# EAGLE design DartScorePcb (EAGLE 9.5.2)
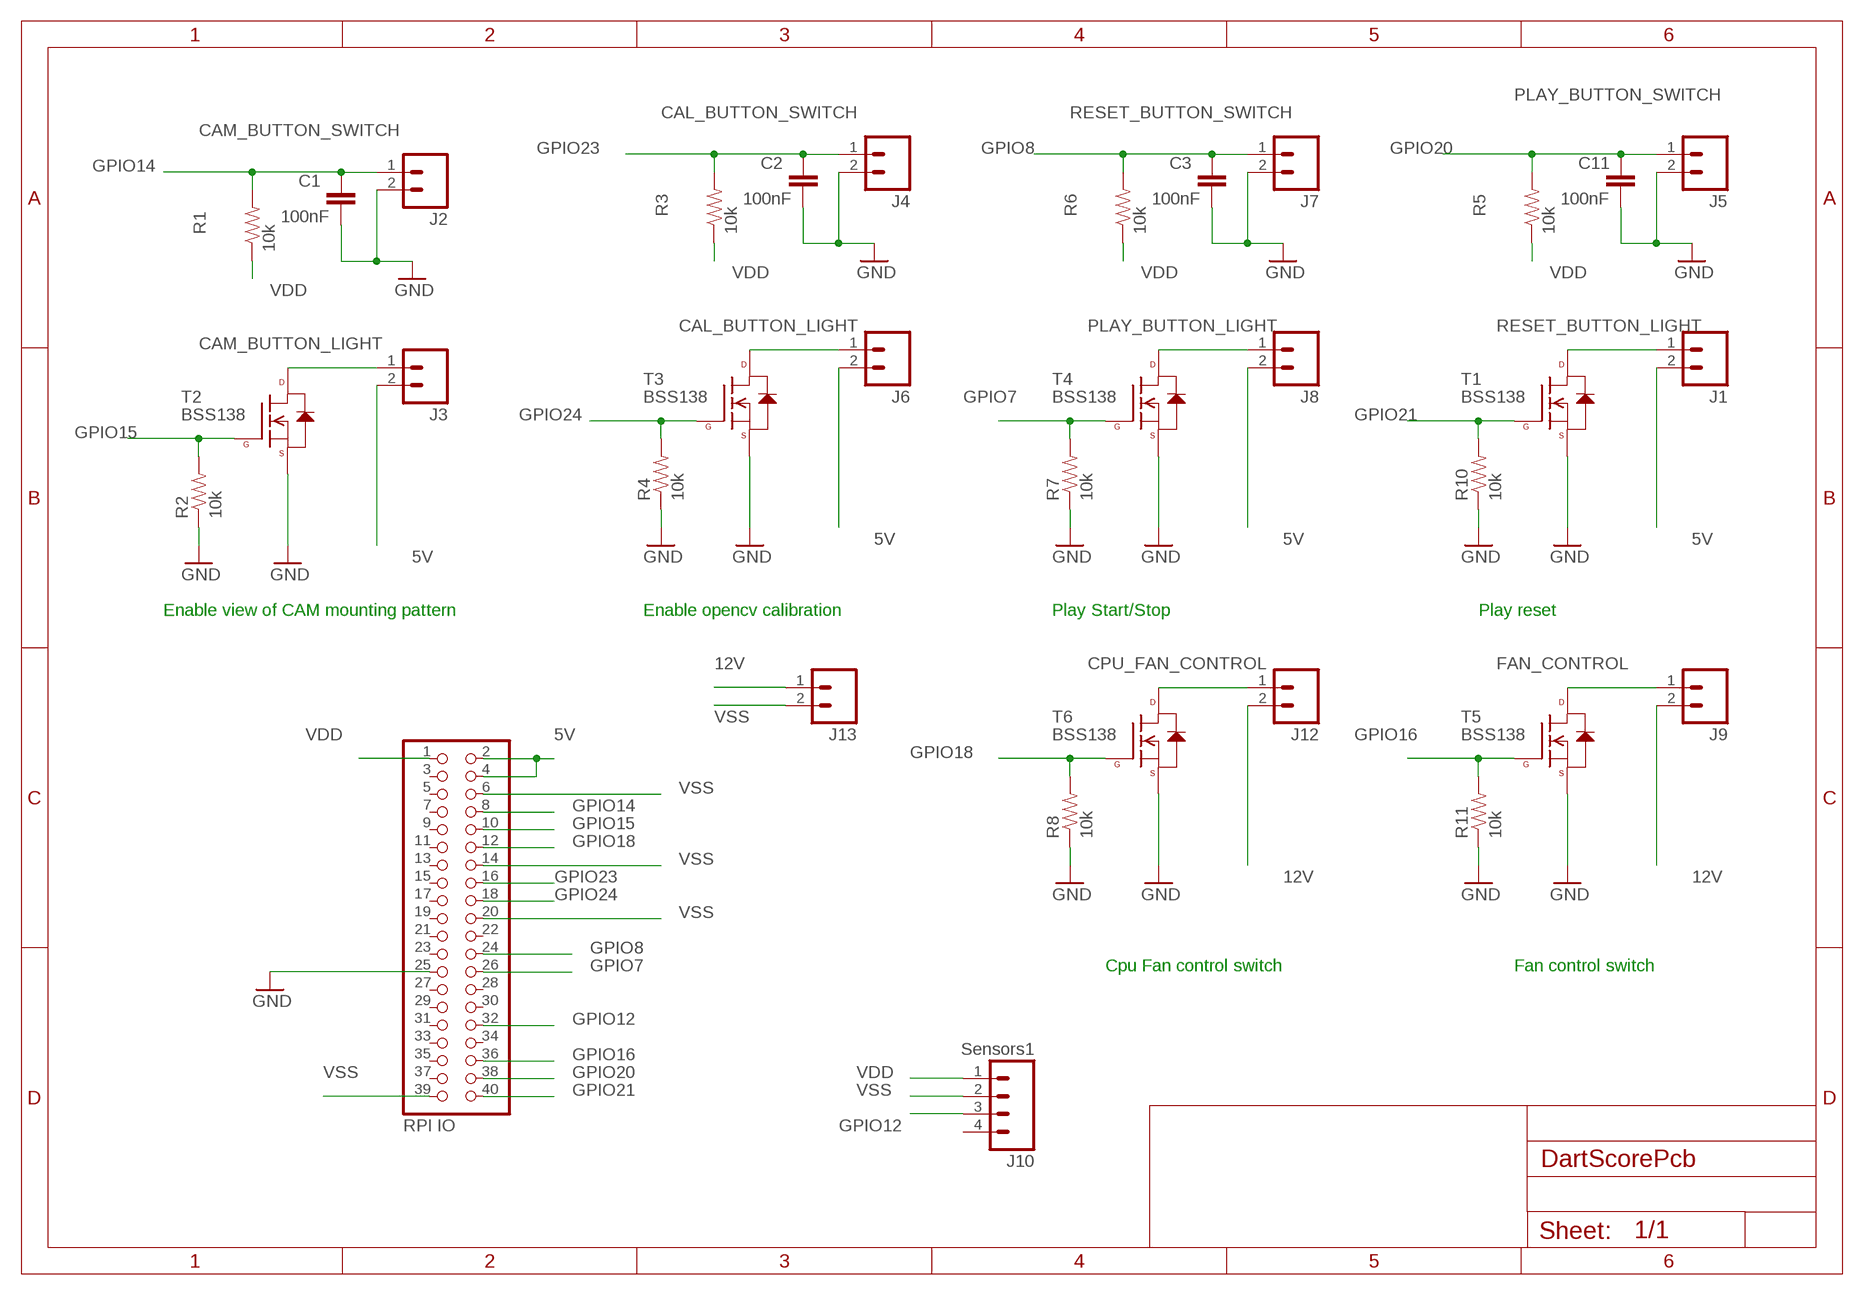
[diagram p0: schematic, sheet 1]

## Parts
C1  100nF  CAP0805  [0805]
C2  100nF  CAP0805  [0805]
C3  100nF  CAP0805  [0805]
C11  100nF  CAP0805  [0805]
J1  RESET_BUTTON_LIGHT  M02PTH  [1X02]
J2  CAM_BUTTON_SWITCH  M02PTH  [1X02]
J3  CAM_BUTTON_LIGHT  M02PTH  [1X02]
J4  CAL_BUTTON_SWITCH  M02PTH  [1X02]
J5  PLAY_BUTTON_SWITCH  M02PTH  [1X02]
J6  CAL_BUTTON_LIGHT  M02PTH  [1X02]
J7  RESET_BUTTON_SWITCH  M02PTH  [1X02]
J8  PLAY_BUTTON_LIGHT  M02PTH  [1X02]
J9  FAN_CONTROL  M02PTH  [1X02]
J10  Sensors1  M04PTH  [1X04]
J12  CPU_FAN_CONTROL  M02PTH  [1X02]
J13  CPU_FAN_CONTROL  M02PTH  [1X02]
JP2  RPI IO  PINHD-2X20  [2X20]
R1  10k  RESISTOR0805-RES  [0805]
R2  10k  RESISTOR0805-RES  [0805]
R3  10k  RESISTOR0805-RES  [0805]
R4  10k  RESISTOR0805-RES  [0805]
R5  10k  RESISTOR0805-RES  [0805]
R6  10k  RESISTOR0805-RES  [0805]
R7  10k  RESISTOR0805-RES  [0805]
R8  10k  RESISTOR0805-RES  [0805]
R10  10k  RESISTOR0805-RES  [0805]
R11  10k  RESISTOR0805-RES  [0805]
T1  BSS138  N-CHANNEL-MOSFET-BSS138  [SOT23-3]
T2  BSS138  N-CHANNEL-MOSFET-BSS138  [SOT23-3]
T3  BSS138  N-CHANNEL-MOSFET-BSS138  [SOT23-3]
T4  BSS138  N-CHANNEL-MOSFET-BSS138  [SOT23-3]
T5  BSS138  N-CHANNEL-MOSFET-BSS138  [SOT23-3]
T6  BSS138  N-CHANNEL-MOSFET-BSS138  [SOT23-3]

## Nets
5V: J1.2 J3.2 J6.2 J8.2 JP2.2 JP2.4
12V: J9.2 J12.2 J13.1
GPIO7: JP2.26 R7.2 T4.1(G)
GPIO8: C3.1 J7.1 JP2.24 R6.2
GPIO12: J10.3 JP2.32
GPIO14: C1.1 J2.1 JP2.8 R1.2
GPIO15: JP2.10 R2.2 T2.1(G)
GPIO16: JP2.36 R11.2 T5.1(G)
GPIO18: JP2.12 R8.2 T6.1(G)
GPIO20: C11.1 J5.1 JP2.38 R5.2
GPIO21: JP2.40 R10.2 T1.1(G)
GPIO23: C2.1 J4.1 JP2.16 R3.2
GPIO24: JP2.18 R4.2 T3.1(G)
N$1: J9.1 T5.3(D)
N$2: J1.1 T1.3(D)
N$3: J12.1 T6.3(D)
N$4: J3.1 T2.3(D)
N$6: J6.1 T3.3(D)
N$8: J8.1 T4.3(D)
VDD: J10.1 JP2.1 R1.1 R3.1 R5.1 R6.1
VSS: C1.2 C2.2 C3.2 C11.2 J2.2 J4.2 J5.2 J7.2 J10.2 J13.2 JP2.6 JP2.14 JP2.20 JP2.25 JP2.39 R2.1 R4.1 R7.1 R8.1 R10.1 R11.1 T1.2(S) T2.2(S) T3.2(S) T4.2(S) T5.2(S) T6.2(S) ; supply symbol labelled GND
Unconnected: J10.4 JP2.3 JP2.5 JP2.7 JP2.9 JP2.11 JP2.13 JP2.15 JP2.17 JP2.19 JP2.21 JP2.22 JP2.23 JP2.27 JP2.28 JP2.29 JP2.30 JP2.31 JP2.33 JP2.34 JP2.35 JP2.37

## Notes on the sheet
- Enable view of CAM mounting pattern | Enable opencv calibration | Play Start/Stop | Play reset
- Cpu Fan control switch | Fan control switch

## Library data of the parts
C1-C3 C11 = SparkFun-Passives:CAP: Capacitor Standard 0603 ceramic capacitor, and 0.1" leaded capacitor.
J1-J9 J12 J13 = SparkFun-Connectors:M02: Standard 2-pin 0.1" header. Use with - straight break away headers ( PRT-00116) - right angle break away headers (PRT-00553) - swiss pins (PRT-00743) - machine pins (PRT-00117) - female headers (PRT-00115) Molex polarized connector foot print use with: PRT-08233 with associated crimp pins and housings. 2.54_SCREWTERM for use with PRT-10571. 3.5mm Screw Terminal footprints for PRT-08084 5mm Screw Terminal footprints for use with PRT-08432
J10 = SparkFun-Connectors:M04: Header 4 Standard 4-pin 0.1" header. Use with straight break away headers (SKU : PRT-00116), right angle break away headers (PRT-00553), swiss pins (PRT-00743), machine pins (PRT-00117), and female headers (PRT-00115). Molex polarized connector foot print use with SKU : PRT-08231 with associated crimp pins and housings. 1MM SMD Version SKU: PRT-10208; PROD_ID: CONN-09696
JP2 = pinhead:PINHD-2X20: PIN HEADER
R1-R8 R10 R11 = SparkFun-Resistors:RESISTOR: Resistor Basic schematic elements and footprints for 0603, 1206, and PTH resistors.
T1-T6 = GeekAmmo:N-CHANNEL-MOSFET: N-Channel MOSFET Mode Field Effect Transistor; DATASHEET: http://www.fairchildsemi.com/ds/BS/BSS138.pdf; DIGIKEY: BSS138TR-ND; ELEMENT14: 2323154; URL: http://au.element14.com/fairchild-semiconductor/bss138/mosfet-n-ch-50v-220ma-sot-23/dp/2323154

## Board
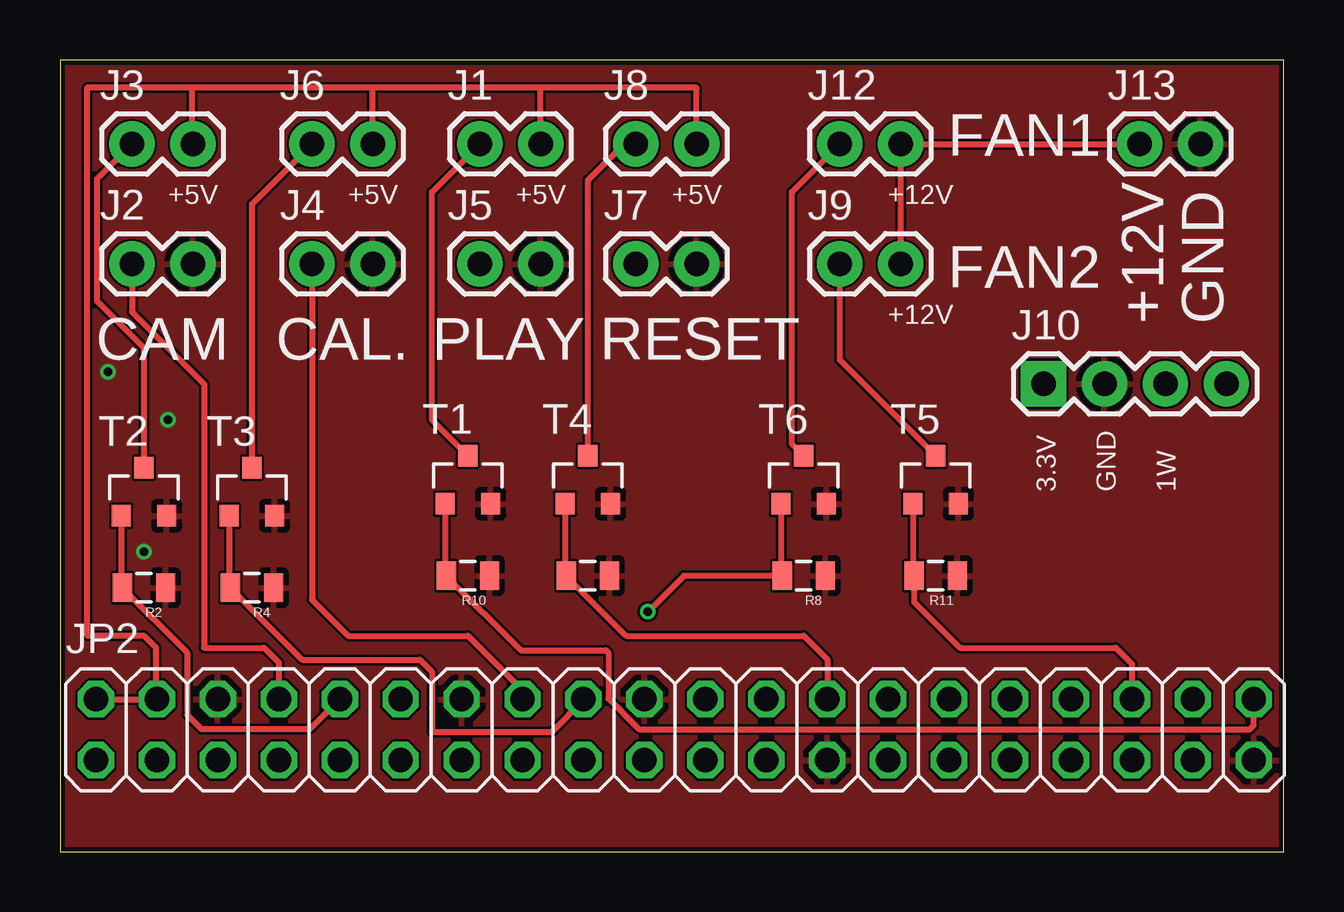
[diagram p1: board, top side]
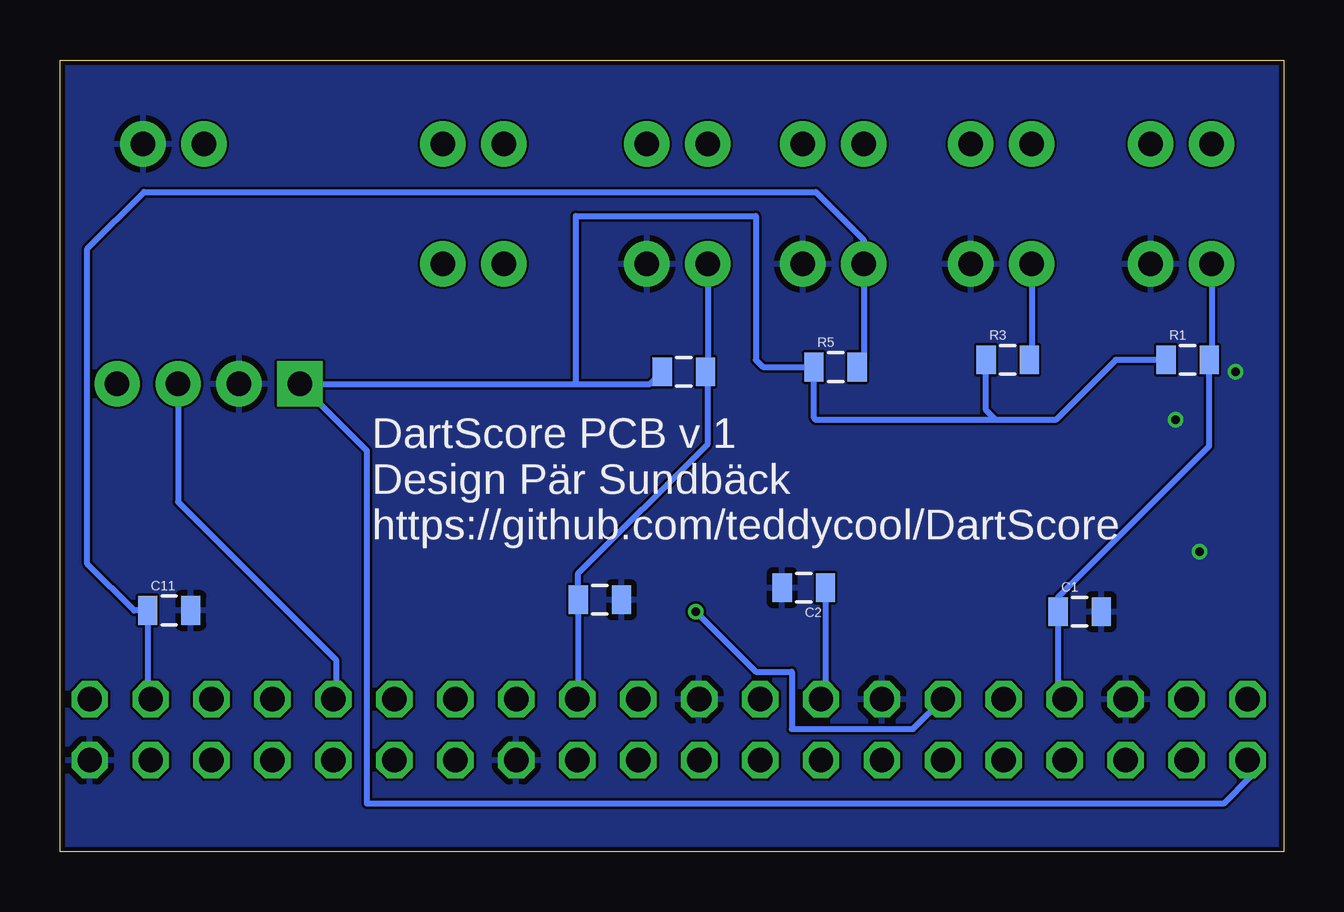
[diagram p2: board, bottom side, seen from below]

Size 51 x 33 mm. Coordinates in mm from the lower left corner, seen from the top.
Outline: 0,0 51,0 51,33 0,33 0,0
Copper layers (1*16): Top 0.035mm / dielectric 1.5mm / Bottom 0.035mm
Design rules "aisler_2_layer": minimum track width 0.1mm, minimum drill 0.2mm, track to track 0.1mm, track to pad 0.1mm, pad to pad 0.1mm, via to via 0.1mm, smd to smd 0.1mm, copper to edge 0.2mm, drill to drill 0.21mm, minimum pad ring 0.25mm, minimum via ring 0.15mm, stop-mask expansion 0mil, vias tented up to drill 0mil, thermal gap 10mil

### Footprints (pad centres in the part's own frame; a part is rotated, then mirrored left to right if it is on the bottom)
0805 = smd 0.8 x 1.2: 1 -0.9,0; 2 0.9,0
1X02 = drill 1.016 pad 1.88: 1 0,0; 2 2.54,0
1X04 = drill 1.016 pad 1.88 square: 1 0,0 | drill 1.016 pad 1.88: 2 2.54,0; 3 5.08,0; 4 7.62,0
2X20 = drill 1.016 octagon: 1 -24.13,-1.27; 2 -24.13,1.27; 3 -21.59,-1.27; 4 -21.59,1.27; 5 -19.05,-1.27; 6 -19.05,1.27; 7 -16.51,-1.27; 8 -16.51,1.27; 9 -13.97,-1.27; 10 -13.97,1.27; 11 -11.43,-1.27; 12 -11.43,1.27; 13 -8.89,-1.27; 14 -8.89,1.27; 15 -6.35,-1.27; 16 -6.35,1.27; 17 -3.81,-1.27; 18 -3.81,1.27; 19 -1.27,-1.27; 20 -1.27,1.27; 21 1.27,-1.27; 22 1.27,1.27; 23 3.81,-1.27; 24 3.81,1.27; 25 6.35,-1.27; 26 6.35,1.27; 27 8.89,-1.27; 28 8.89,1.27; 29 11.43,-1.27; 30 11.43,1.27; 31 13.97,-1.27; 32 13.97,1.27; 33 16.51,-1.27; 34 16.51,1.27; 35 19.05,-1.27; 36 19.05,1.27; 37 21.59,-1.27; 38 21.59,1.27; 39 24.13,-1.27; 40 24.13,1.27
SOT23-3 = smd 0.8 x 0.9: 1 -0.95,-1; 2 0.95,-1; 3 0,1

### Placement (x,y rotation side)
C1  8.5,10 0 bottom
C2  20,11 180 bottom
C3  28.5,10.5 0 bottom
C11  46.45,10.05 0 bottom
J1  17.5,29.5 0 top
J2  3,24.5 0 top
J3  3,29.5 0 top
J4  10.5,24.5 0 top
J5  17.5,24.5 0 top
J6  10.5,29.5 0 top
J7  24,24.5 0 top
J8  24,29.5 0 top
J9  32.5,24.5 0 top
J10  41,19.5 0 top
J12  32.5,29.5 0 top
J13  45,29.5 0 top
JP2  25.63,5.08 0 top
R1  4,20.5 0 bottom
R2  3.5,11 180 top
R3  11.5,20.5 0 bottom
R4  8,11 180 top
R5  18.67,20.2 0 bottom
R6  25,20 0 bottom
R7  22,11.5 180 top
R8  31,11.5 180 top
R10  17,11.5 180 top
R11  36.5,11.5 180 top
T1  17,15.5 0 top
T2  3.5,15 0 top
T3  8,15 0 top
T4  22,15.5 0 top
T5  36.5,15.5 0 top
T6  31,15.5 0 top

### Tracks (layer width: path | path; a pad name or v marks a point on that pad's centre or on a via)
5V
  Top 0.254: 5.5,31.86 1.14,31.86 1.14,9 3.5,9 4,8.5 4,6.39 JP2.4 JP2.2 | 5.5,31.86 13,31.86 | 13,31.86 20,31.86 | 20,31.86 26.5,31.86 26.54,31.82 J8.2 | J3.2 5.5,29.54 5.5,31.86 | J6.2 13.04,31.82 13,31.86 | J1.2 20.04,31.82 20,31.86
12V
  Top 0.254: J9.2 J12.2 J13.1
GPIO7
  Top 0.254: T4.1 21.05,11.55 R7.2 23.6,9 31,9 31.98,8.02 JP2.26
GPIO8
  Bottom 0.254: JP2.24 29.4,6.39 C3.1 29.4,11.6 24,17 24,20.1 | J7.1 24,20.1 | 24,20.1 R6.2
GPIO12
  Bottom 0.254: J10.3 46.08,14.58 41,9.5 39.5,8 39.5,6.45 JP2.32
GPIO14
  Top 0.254: JP2.8 9.12,7.88 8.5,8.5 6,8.5 6,19.5 3,22.5 J2.1
  Bottom 0.254: JP2.8 9.4,6.63 C1.1 9.4,10.6 3.1,16.9 R1.2 3,20.6 J2.1
GPIO15
  Top 0.254: JP2.10 10.41,5.1 5.9,5.1 5.3,5.7 5.3,8.3 R2.2 2.55,11.05 T2.1
GPIO16
  Top 0.254: T5.1 35.55,11.55 R11.2 35.6,10.4 37.5,8.5 44,8.5 44.68,7.82 JP2.36
GPIO18  (via drill 0.35)
  Top 0.254: T6.1 30.05,11.55 R8.2 26,11.5 v24.5,10
  Bottom 0.254: v24.5,10 22,7.5 20.5,7.5 20.5,5.11 15.44,5.11 JP2.12
GPIO20
  Bottom 0.254: JP2.38 47.35,6.48 C11.1 47.91,10.05 49.86,12 49.86,25.14 47.5,27.5 19.5,27.5 17.5,25.5 J5.1 17.5,24 17.5,20.47 R5.2
GPIO21
  Top 0.254: T1.1 16.05,11.55 R10.2 19.21,8.39 22.75,8.39 22.86,8.28 22.86,6.38 24.14,5.1 49.6,5.1 49.76,5.26 JP2.40
GPIO23
  Top 0.254: J4.1 10.5,10.5 12,9 17,9 19.28,6.72 JP2.16
  Bottom 0.254: C2.1 19.1,6.53 JP2.16 | J4.1 10.5,20.6 R3.2
GPIO24
  Top 0.254: T3.1 7.05,11.05 R4.2 10.1,8 15,8 15.5,7.5 15.5,6 15.5,5 20.5,5 21.82,6.32 JP2.18
N$1
  Top 0.254: T5.3 32.5,20.5 J9.1
N$2
  Top 0.254: T1.3 15.5,18 15.5,27.5 J1.1
N$3
  Top 0.254: T6.3 30.5,17 30.5,27.5 J12.1
N$4
  Top 0.254: T2.3 3.5,21 1.55,22.95 1.55,28.05 J3.1
N$6
  Top 0.254: T3.3 8,27 J6.1
N$8
  Top 0.254: T4.3 22,28 23.5,29.5 J8.1
VDD
  Bottom 0.254: R1.1 7,20.5 9.5,18 12,18 | 12,18 12.4,18.4 R3.1 | 12,18 19.5,18 19.57,18.07 R5.1 21.7,20.2 22,20.5 22,26.5 29.5,26.5 29.5,19.5 | JP2.1 1.41,3.9 1.41,3.1 2.5,2 38.2,2 38.2,16.7 J10.1 29.5,19.5 | 29.5,19.5 26.4,19.5 R6.1
VSS  (via drill 0.35)
  other vias: 2,20 3.5,12.5 4.5,18
  pour Bottom: 51,33 51,0 0.5,0 0,0.5 0,33
  pour Top: 0,33 0,0 51,0 51,33

### Text on the board
tNames: FAN1 | +5V | +5V | +5V | +5V | +12V | FAN2 | +12V | +12V | GND | CAM | CAL. | PLAY | RESET | 3.3V | GND | 1W
bNames: DartScore PCB v 1 / Design Pär Sundbäck / https://github.com/teddycool/DartScore